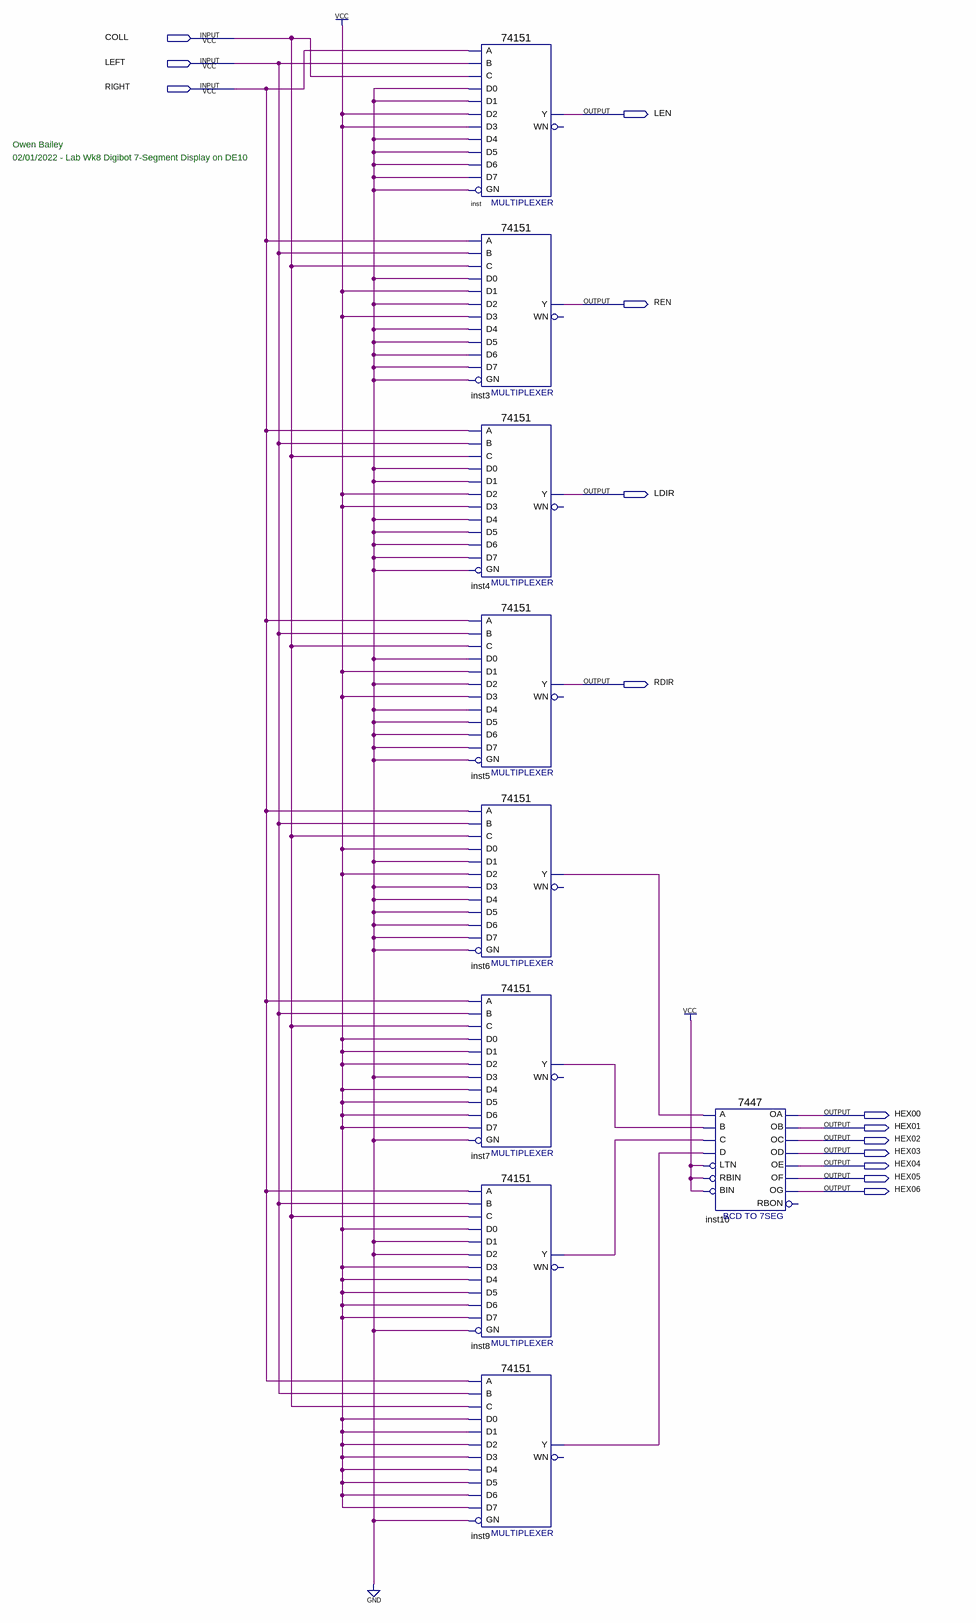
[diagram p0: schematic sheet]
// Quartus schematic digibotdisplay.bdf as structural Verilog: 9 symbols, 14 pins
module digibotdisplay (
  input  COLL,
  input  LEFT,
  input  RIGHT,
  output LEN,
  output REN,
  output LDIR,
  output RDIR,
  output HEX00,
  output HEX01,
  output HEX02,
  output HEX03,
  output HEX04,
  output HEX05,
  output HEX06
);

  wire inst6_y, inst7_y, inst8_y, inst9_y;

  \74151  inst (
    .GN(1'b0), .C(COLL), .B(LEFT), .A(RIGHT), .D5(1'b0), .D0(1'b0), .D1(1'b0), .D4(1'b0), .D3(1'b1),
    .D2(1'b1), .D6(1'b0), .D7(1'b0), .Y(LEN));  // open: WN
  \74151  inst3 (
    .GN(1'b0), .C(COLL), .B(LEFT), .A(RIGHT), .D5(1'b0), .D0(1'b0), .D1(1'b1), .D4(1'b0), .D3(1'b1),
    .D2(1'b0), .D6(1'b0), .D7(1'b0), .Y(REN));  // open: WN
  \74151  inst4 (
    .GN(1'b0), .C(COLL), .B(LEFT), .A(RIGHT), .D5(1'b0), .D0(1'b0), .D1(1'b0), .D4(1'b0), .D3(1'b1),
    .D2(1'b1), .D6(1'b0), .D7(1'b0), .Y(LDIR));  // open: WN
  \74151  inst5 (
    .GN(1'b0), .C(COLL), .B(LEFT), .A(RIGHT), .D5(1'b0), .D0(1'b0), .D1(1'b1), .D4(1'b0), .D3(1'b1),
    .D2(1'b0), .D6(1'b0), .D7(1'b0), .Y(RDIR));  // open: WN
  \74151  inst6 (
    .GN(1'b0), .C(COLL), .B(LEFT), .A(RIGHT), .D5(1'b0), .D0(1'b1), .D1(1'b0), .D4(1'b0), .D3(1'b0),
    .D2(1'b1), .D6(1'b0), .D7(1'b0), .Y(inst6_y));  // open: WN
  \74151  inst7 (
    .GN(1'b0), .C(COLL), .B(LEFT), .A(RIGHT), .D5(1'b1), .D0(1'b1), .D1(1'b1), .D4(1'b1), .D3(1'b0),
    .D2(1'b1), .D6(1'b1), .D7(1'b1), .Y(inst7_y));  // open: WN
  \74151  inst8 (
    .GN(1'b0), .C(COLL), .B(LEFT), .A(RIGHT), .D5(1'b1), .D0(1'b1), .D1(1'b0), .D4(1'b1), .D3(1'b1),
    .D2(1'b0), .D6(1'b1), .D7(1'b1), .Y(inst8_y));  // open: WN
  \74151  inst9 (
    .GN(1'b0), .C(COLL), .B(LEFT), .A(RIGHT), .D5(1'b1), .D0(1'b1), .D1(1'b1), .D4(1'b1), .D3(1'b1),
    .D2(1'b1), .D6(1'b1), .D7(1'b1), .Y(inst9_y));  // open: WN
  \7447  inst10 (
    .LTN(1'b1), .B(inst7_y), .C(inst8_y), .D(inst9_y), .RBIN(1'b1), .BIN(1'b1), .A(inst6_y), .OB(HEX01),
    .OC(HEX02), .OE(HEX04), .OD(HEX03), .OF(HEX05), .OG(HEX06), .OA(HEX00));  // open: RBON

  // Notes on the sheet:
  //   Owen Bailey
  //   02/01/2022 - Lab Wk8 Digibot 7-Segment Display on DE10
endmodule
